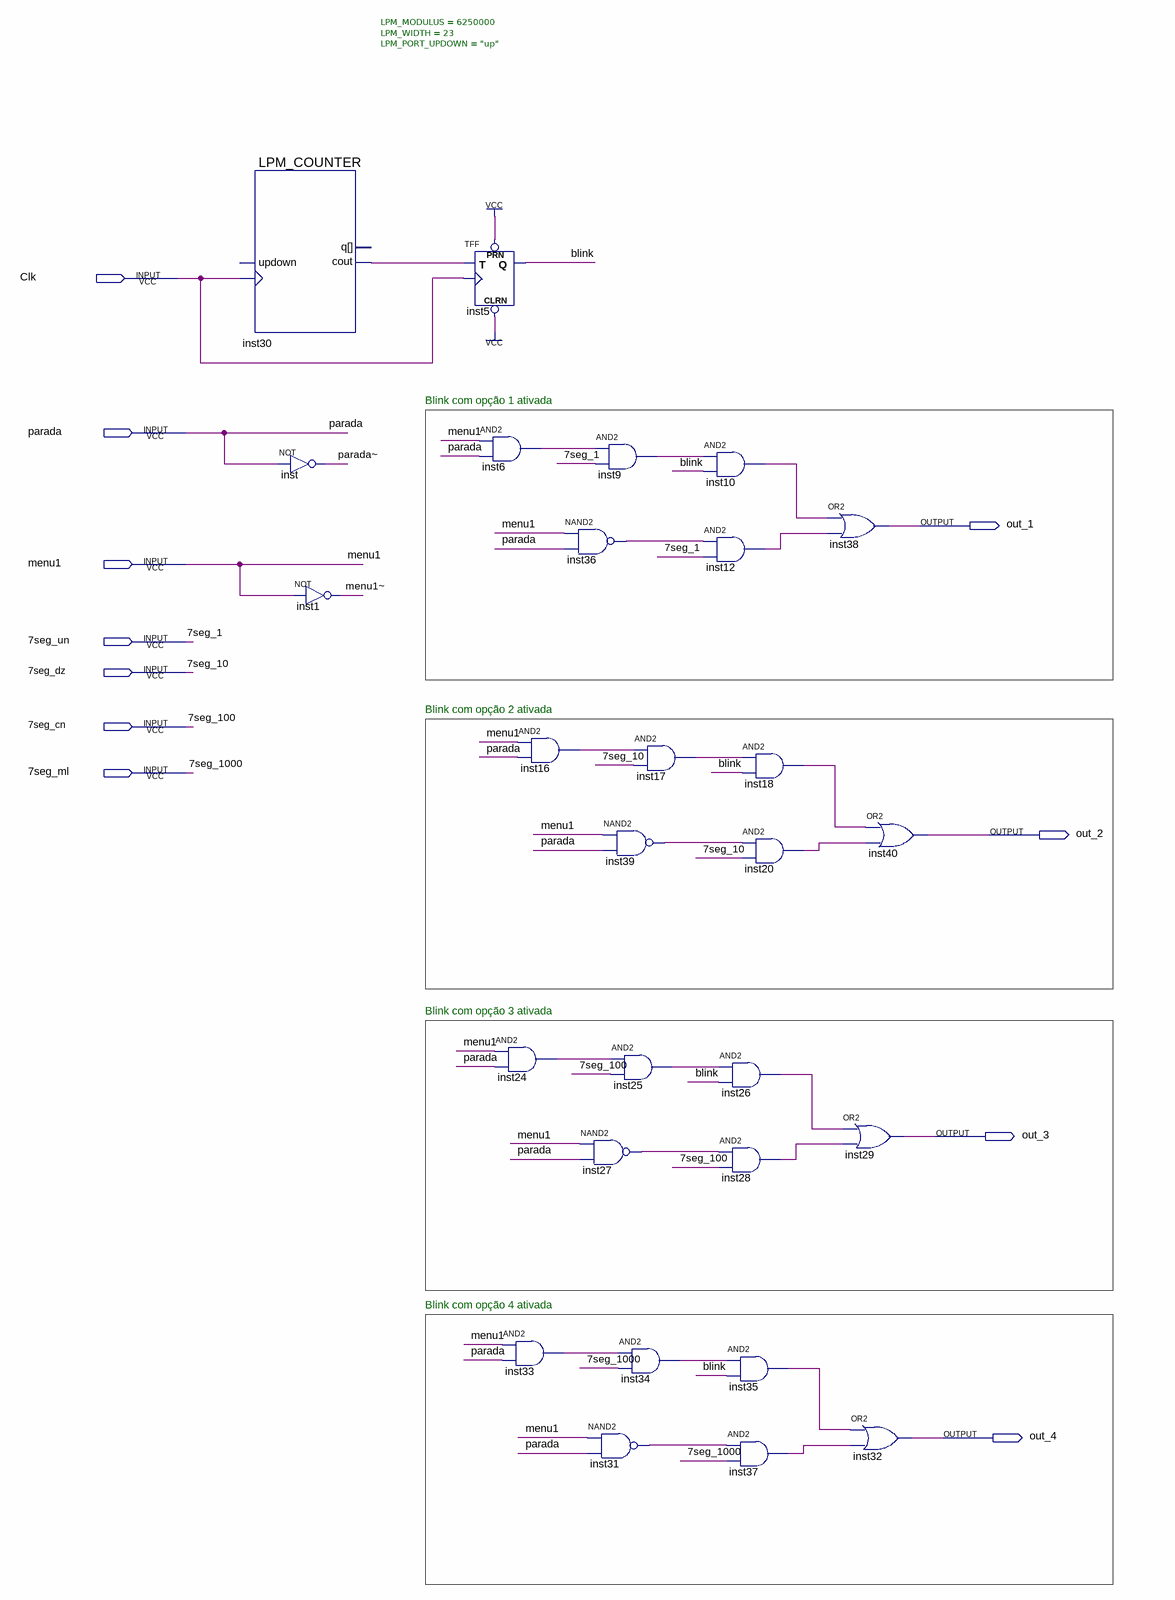
[diagram p0: schematic sheet]
// Quartus schematic Blink_final.bdf as structural Verilog: 28 symbols, 11 pins
module Blink_final (
  input  Clk,
  input  parada,
  input  menu1,
  input  \7seg_un ,
  input  \7seg_dz ,
  input  \7seg_cn ,
  input  \7seg_ml ,
  output out_1,
  output out_2,
  output out_3,
  output out_4
);

  wire blink, inst6_out, inst9_out, inst10_out, inst12_out, inst16_out, inst17_out, inst18_out, inst20_out,
       inst24_out, inst25_out, inst26_out, inst27_out, inst28_out, inst30_cout, inst31_out, inst33_out,
       inst34_out, inst35_out, inst36_out, inst37_out, inst39_out, \menu1~ , \parada~ ;

  LPM_COUNTER #(.LPM_MODULUS(6250000), .LPM_WIDTH(23), .LPM_PORT_UPDOWN("up")) inst30 (
    .clock(Clk), .cout(inst30_cout));  // open: updown, q
  not inst (\parada~ , parada);
  not inst1 (\menu1~ , menu1);
  TFF inst5 (.PRN(1'b1), .CLRN(1'b1), .T(inst30_cout), .CLK(Clk), .Q(blink));
  and inst6 (inst6_out, menu1, parada);
  and inst24 (inst24_out, menu1, parada);
  and inst33 (inst33_out, menu1, parada);
  nand inst36 (inst36_out, menu1, parada);
  and inst16 (inst16_out, menu1, parada);
  and inst9 (inst9_out, inst6_out, \7seg_un );
  nand inst39 (inst39_out, menu1, parada);
  and inst25 (inst25_out, inst24_out, \7seg_cn );
  nand inst27 (inst27_out, menu1, parada);
  and inst34 (inst34_out, inst33_out, \7seg_ml );
  nand inst31 (inst31_out, menu1, parada);
  and inst17 (inst17_out, inst16_out, \7seg_dz );
  and inst10 (inst10_out, inst9_out, blink);
  and inst12 (inst12_out, inst36_out, \7seg_un );
  and inst18 (inst18_out, inst17_out, blink);
  and inst20 (inst20_out, inst39_out, \7seg_dz );
  and inst26 (inst26_out, inst25_out, blink);
  and inst28 (inst28_out, inst27_out, \7seg_cn );
  and inst35 (inst35_out, inst34_out, blink);
  and inst37 (inst37_out, inst31_out, \7seg_ml );
  or inst38 (out_1, inst10_out, inst12_out);
  or inst40 (out_2, inst18_out, inst20_out);
  or inst29 (out_3, inst26_out, inst28_out);
  or inst32 (out_4, inst35_out, inst37_out);

  // Other names for the same wires on the sheet: 7seg_1 = \7seg_un ; 7seg_10 = \7seg_dz ; 7seg_100 = \7seg_cn ;
  //   7seg_1000 = \7seg_ml 

  // Notes on the sheet:
  //   Blink com opção 1 ativada
  //   Blink com opção 2 ativada
  //   Blink com opção 3 ativada
  //   Blink com opção 4 ativada
endmodule
